# EAGLE schematic scanner_sch (EAGLE 9.5.1)
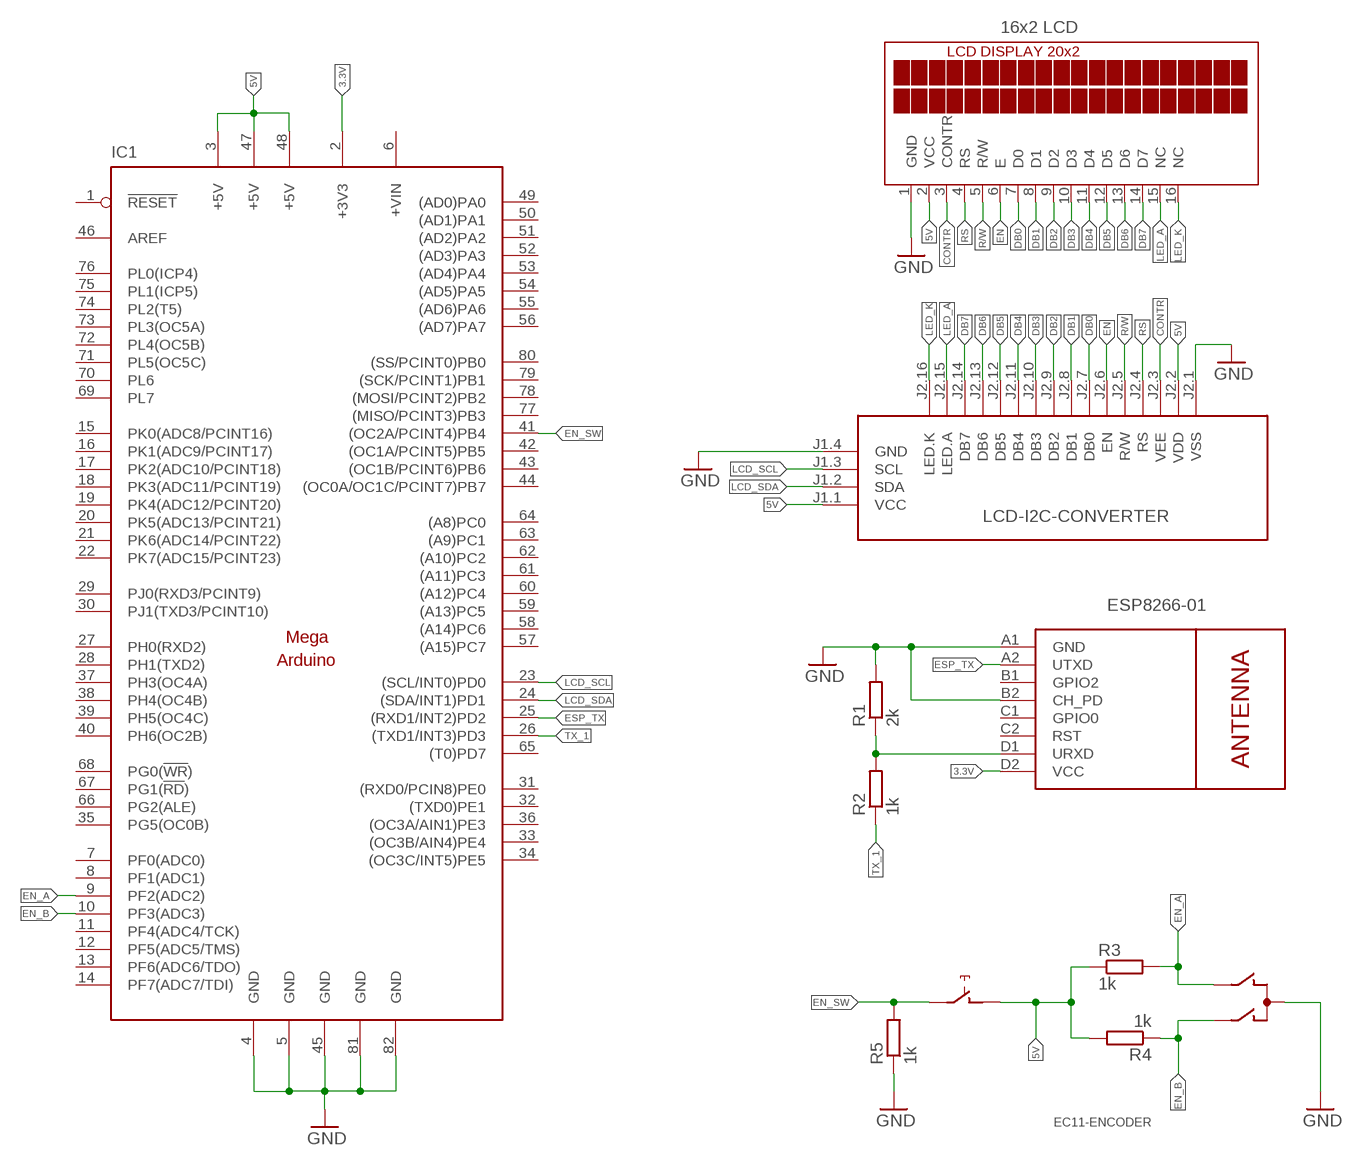
[diagram p0: schematic, sheet 1]

## Parts
DIS1  16x2 LCD  TUXGR_20X2  [TUXGR_20X2]
IC1  MEGAARDUINO_1  [MEGA_ARDUINO]
R1  2k  R-EU_0207/5V  [0207/5V]
R2  1k  R-EU_0207/5V  [0207/5V]
R3  1k  R-EU_0207/5V  [0207/5V]
R4  1k  R-EU_0207/5V  [0207/5V]
R5  1k  R-EU_0207/5V  [0207/5V]
SW1  EC11-ENCODER  EC12E_SW  [ALPS_EC12E_SW]
U$1  LCD-I2C-CONVERTER  [LCD-I2C-CONVERTER]
U$2  ESP8266-01  WIRELESS-WIFI-ESP-01  [WIRELESS-WIFI-ESP-01]

## Nets
3.3V: IC1.2(+3V3) U$2.D2(VCC)
5V: DIS1.2(VCC) IC1.3(+5V) IC1.47(+5V) IC1.48(+5V) R3.1 R4.2 SW1.D U$1.J1.1(VCC) U$1.J2.2(VDD)
CONTR: DIS1.3(CONTR) U$1.J2.3(VEE)
DB0: DIS1.7(D0) U$1.J2.7(DB0)
DB1: DIS1.8(D1) U$1.J2.8(DB1)
DB2: DIS1.9(D2) U$1.J2.9(DB2)
DB3: DIS1.10(D3) U$1.J2.10(DB3)
DB4: DIS1.11(D4) U$1.J2.11(DB4)
DB5: DIS1.12(D5) U$1.J2.12(DB5)
DB6: DIS1.13(D6) U$1.J2.13(DB6)
DB7: DIS1.14(D7) U$1.J2.14(DB7)
EN: DIS1.6(E) U$1.J2.6(EN)
EN_A: IC1.9(PF2(ADC2)) R3.2 SW1.B
EN_B: IC1.10(PF3(ADC3)) R4.1 SW1.A
EN_SW: IC1.41((OC2A/PCINT4)PB4) R5.2 SW1.E
ESP_TX: IC1.25((RXD1/INT2)PD2) U$2.A2(UTXD)
GND: DIS1.1(GND) IC1.4(GND) IC1.5(GND) IC1.45(GND) IC1.81(GND) IC1.82(GND) R1.2 R5.1 SW1.C U$1.J1.4(GND) U$1.J2.1(VSS) U$2.A1(GND) U$2.B2(CH_PD)
LCD_SCL: IC1.23((SCL/INT0)PD0) U$1.J1.3(SCL)
LCD_SDA: IC1.24((SDA/INT1)PD1) U$1.J1.2(SDA)
LED_A: DIS1.15(NC) U$1.J2.15(LED.A)
LED_K: DIS1.16(NC) U$1.J2.16(LED.K)
N$1: R1.1 R2.2 U$2.D1(URXD)
R/W: DIS1.5(R/W) U$1.J2.5(R/W)
RS: DIS1.4(RS) U$1.J2.4(RS)
TX_1: IC1.26((TXD1/INT3)PD3) R2.1
Unconnected: IC1.1(!RESET) IC1.7(PF0(ADC0)) IC1.8(PF1(ADC1)) IC1.11(PF4(ADC4/TCK)) IC1.12(PF5(ADC5/TMS)) IC1.13(PF6(ADC6/TDO)) IC1.14(PF7(ADC7/TDI)) IC1.15(PK0(ADC8/PCINT16)) IC1.16(PK1(ADC9/PCINT17)) IC1.17(PK2(ADC10/PCINT18)) IC1.18(PK3(ADC11/PCINT19)) IC1.19(PK4(ADC12/PCINT20)) IC1.20(PK5(ADC13/PCINT21)) IC1.21(PK6(ADC14/PCINT22)) IC1.22(PK7(ADC15/PCINT23)) IC1.27(PH0(RXD2)) IC1.28(PH1(TXD2)) IC1.29(PJ0(RXD3/PCINT9)) IC1.30(PJ1(TXD3/PCINT10)) IC1.31((RXD0/PCIN8)PE0) IC1.32((TXD0)PE1) IC1.33((OC3B/AIN4)PE4) IC1.34((OC3C/INT5)PE5) IC1.35(PG5(OC0B)) IC1.36((OC3A/AIN1)PE3) IC1.37(PH3(OC4A)) IC1.38(PH4(OC4B)) IC1.39(PH5(OC4C)) IC1.40(PH6(OC2B)) IC1.42((OC1A/PCINT5)PB5) IC1.43((OC1B/PCINT6)PB6) IC1.44((OC0A/OC1C/PCINT7)PB7) IC1.46(AREF) IC1.49((AD0)PA0) IC1.50((AD1)PA1) IC1.51((AD2)PA2) IC1.52((AD3)PA3) IC1.53((AD4)PA4) IC1.54((AD5)PA5) IC1.55((AD6)PA6) IC1.56((AD7)PA7) IC1.57((A15)PC7) IC1.58((A14)PC6) IC1.59((A13)PC5) IC1.60((A12)PC4) IC1.61((A11)PC3) IC1.62((A10)PC2) IC1.63((A9)PC1) IC1.64((A8)PC0) IC1.65((T0)PD7) IC1.66(PG2(ALE)) IC1.67(PG1(!RD!)) IC1.68(PG0(!WR!)) IC1.69(PL7) IC1.70(PL6) IC1.71(PL5(OC5C)) IC1.72(PL4(OC5B)) IC1.73(PL3(OC5A)) IC1.74(PL2(T5)) IC1.75(PL1(ICP5)) IC1.76(PL0(ICP4)) IC1.77((MISO/PCINT3)PB3) IC1.78((MOSI/PCINT2)PB2) IC1.79((SCK/PCINT1)PB1) IC1.80((SS/PCINT0)PB0) SW1.GND1(G) SW1.GND2(G) U$2.B1(GPIO2) U$2.C1(GPIO0) U$2.C2(RST)

## Power pins joined to a net without a drawn wire
+VIN: IC1.6(+VIN)

## Library data of the parts
DIS1 = display-lcd:TUXGR_20X2: Tuxgraphics LCD display 20x2 characters reflective, without background light Source: tuxgr_20x2.pdf; OC_FARNELL: unknown; OC_NEWARK: unknown
IC1 = arduino:MEGAARDUINO_1: The Arduino Mega is a microcontroller board based on the ATmega1280. - 54 digital input/output pins (of which 14 can be used as PWM outputs) - 16 analog inputs - 4 UARTs (hardware serial ports) - 16 MHz crystal oscillator - USB connection - power jack - ICSP header - reset button It contains everything needed to support the microcontroller; simply connect it to a computer with a USB cable or power it with a AC-to-DC adapter or battery to get started. The Mega is compatible with most shields designed for the Arduino Duemilanove or Diecimila. http://arduino.cc/en/Main/ArduinoBoardMega
R1-R5 = rcl:R-EU_: RESISTOR, European symbol; SPICEPREFIX: R
SW1 = switch-alps:EC12E_SW: ALPS rotary Encoder EC12E series with switch; MPN: EC12E2424407; OC_FARNELL: 1520813; OC_NEWARK: 74M1068
U$1 = I2C_lcd:LCD-I2C-CONVERTER: I2C Bus to 4-Bit Parallel LCD Interface with LED backlight driver
U$2 = esp8266-01:WIRELESS-WIFI-ESP-01: Wireless Wi-Fi ESP-01 Module based on ESP8266 chip Click here to find device on ebay.com <http://www.ebay.com/sch/esp8266+esp+01+transceiver>